# Altium schematic sheet SPI Counter.SchDoc: SPI Counter
size A3; SheetNumber: 1; SheetTotal: 1; PartNumber: PNxxx; Drawn By: Sebastian Kulik; ProjectName: DVT SPI Buffer
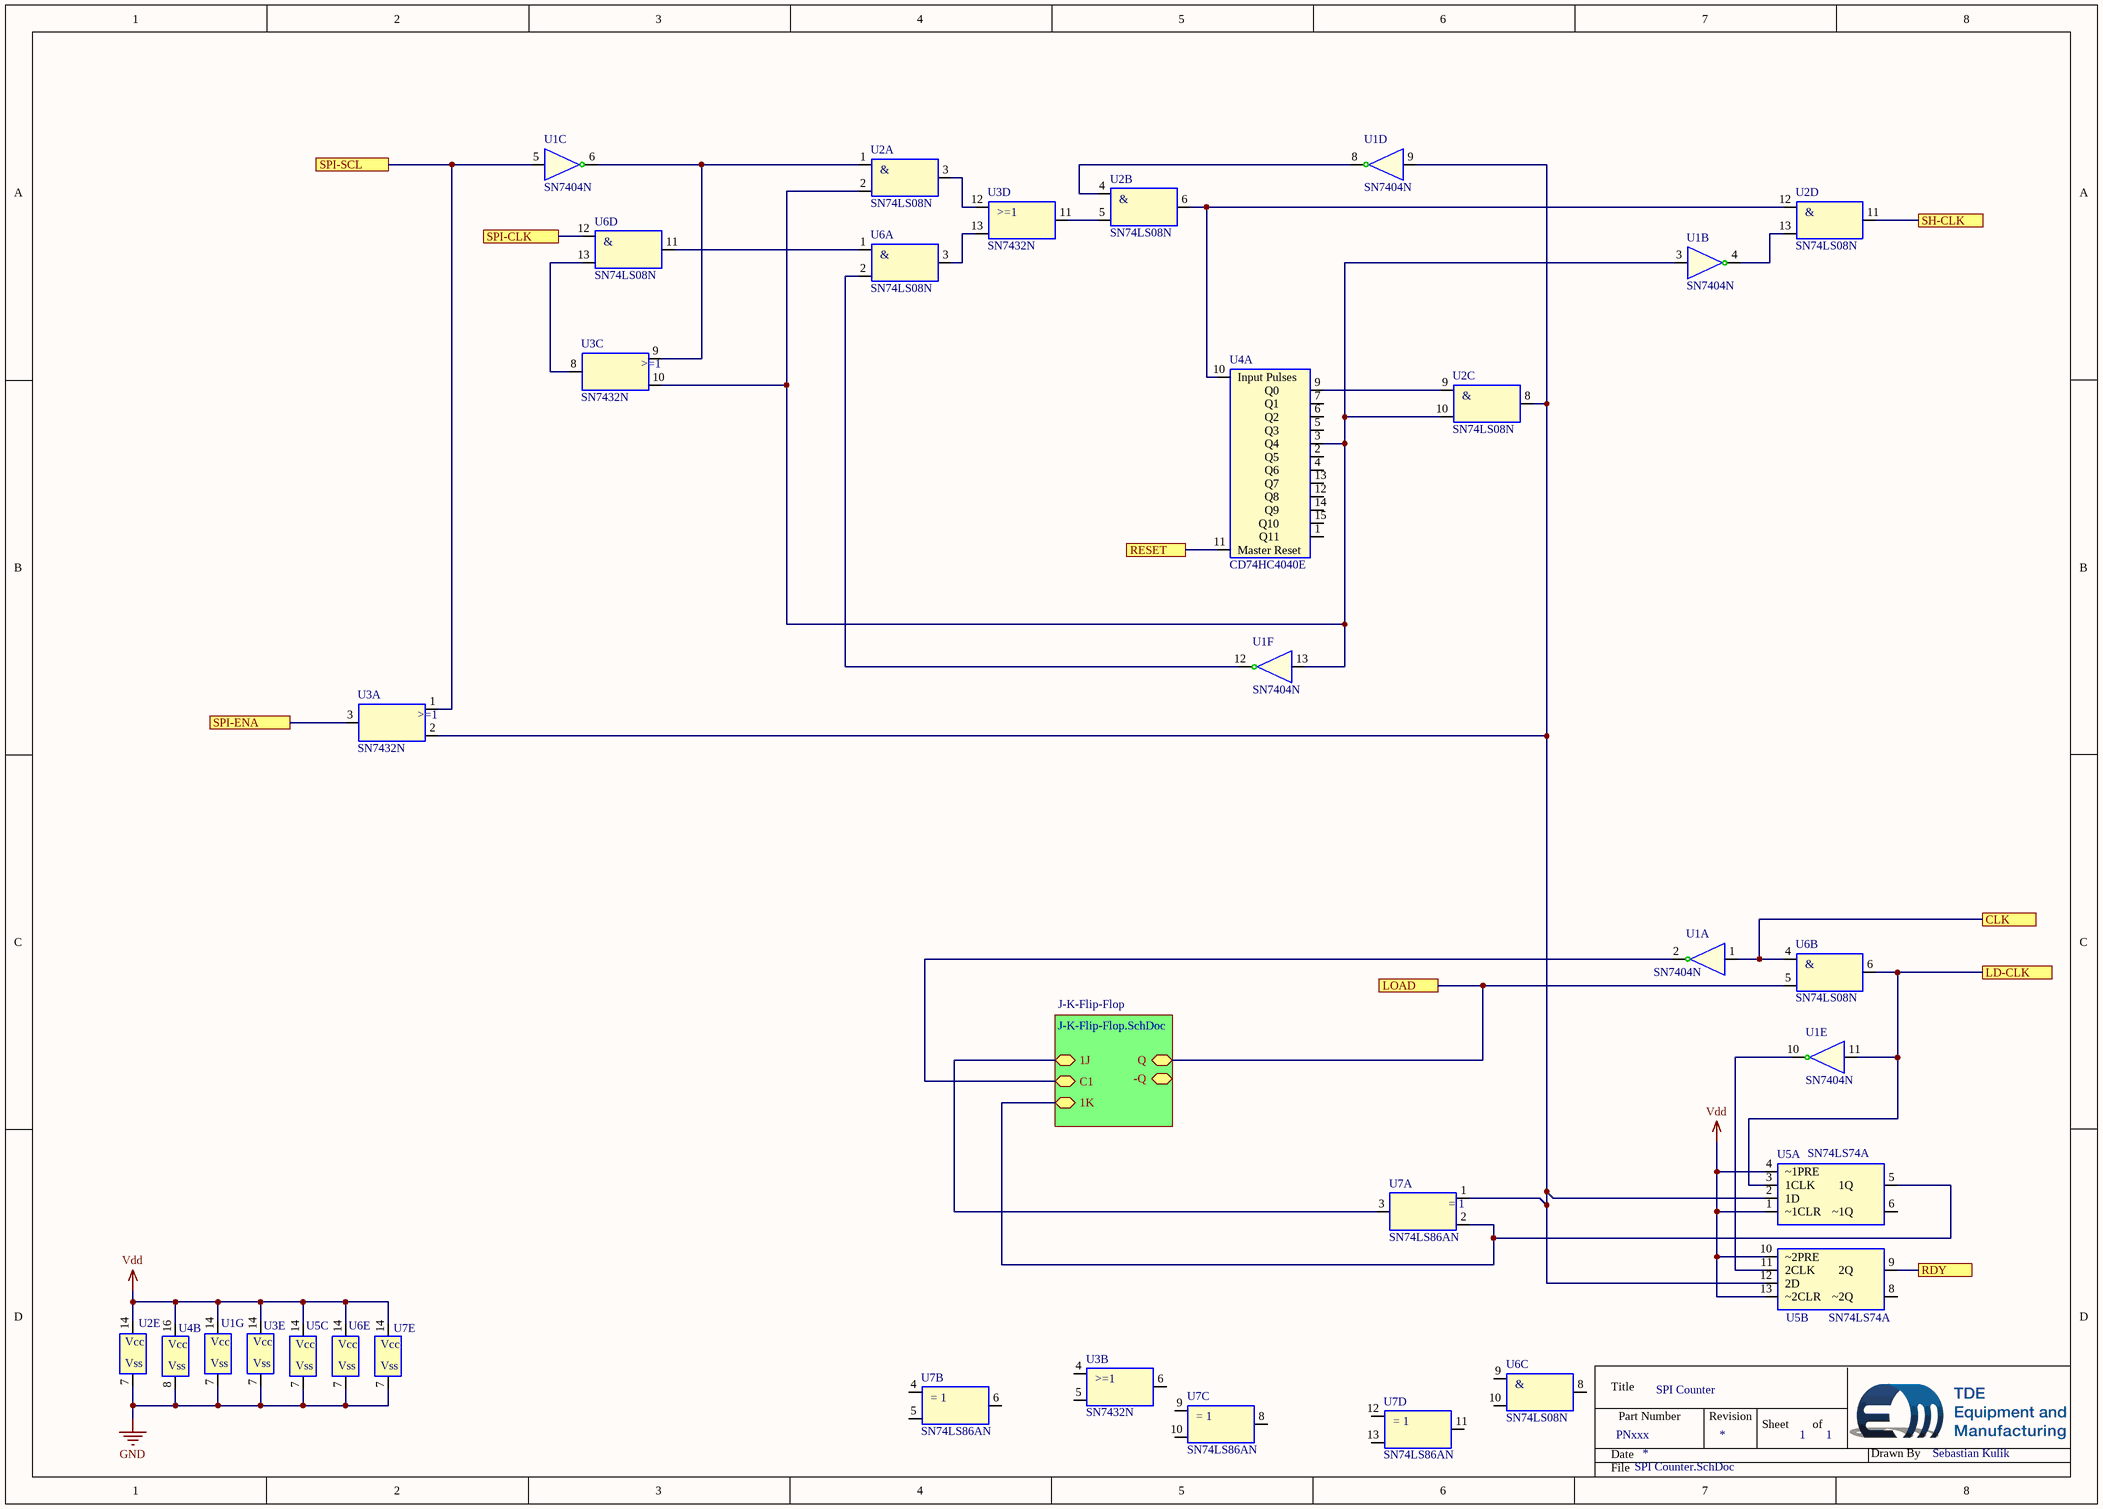
[diagram p0: SPI Counter.SchDoc]

## Parts
U1  SN7404N  [DIP-14]  (parts A,B,C,D,E,F,G of 7)
U2  SN74LS08N  [DIP-14]  (parts A,B,C,D,E of 5)
U3  SN7432N  [DIP-14]  (parts A,B,C,D,E of 5)
U4  CD74HC4040E  [DIP-16]  (parts A,B of 2)
U5  SN74LS74A  [DIP-14]  (parts A,B,C of 3)
U6  SN74LS08N  [DIP-14]  (parts A,B,C,D,E of 5)
U7  SN74LS86AN  [DIP-14]  (parts A,B,C,D,E of 5)

## Sub-sheets
J-K-Flip-Flop = J-K-Flip-Flop.SchDoc: 1J, C1, 1K, Q, -Q

## Ports
CLK, LD-CLK, LOAD, RDY, RESET, SH-CLK, SPI-CLK, SPI-ENA, SPI-SCL

## Nets
GND: U1.7(Vss) U2.7(Vss) U3.7(Vss) U4.8(Vss) U5.7(Vss) U6.7(Vss) U7.7(Vss)
Vdd: U1.14(Vcc) U2.14(Vcc) U3.14(Vcc) U4.16(Vcc) U5.1(~1CLR) U5.4(~1PRE) U5.10(~2PRE) U5.13(~2CLR) U5.14(Vcc) U6.14(Vcc) U7.14(Vcc)
CLK: U1.1(1A) U6.4(2A) ; port CLK
LD-CLK: U1.11(5A) U5.3(1CLK) U6.6(Y2) ; port LD-CLK
LOAD: U6.5(2B) ; port LOAD, sheet J-K-Flip-Flop/Q
RDY: U5.9(2Q) ; port RDY
RESET: U4.11(Master_Reset) ; port RESET
SH-CLK: U2.11(Y4) ; port SH-CLK
SPI-CLK: U6.12(4A) ; port SPI-CLK
SPI-ENA: U3.3(Y1) ; port SPI-ENA
SPI-SCL: U1.5(3A) U3.1(1A) ; port SPI-SCL
NetU1_2: U1.2(1Y) ; sheet J-K-Flip-Flop/C1
NetU1_3: U1.3(2A) U1.13(6A) U2.2(1B) U2.10(3B) U3.10(3B) U4.3(Q4)
NetU1_4: U1.4(2Y) U2.13(4B)
NetU1_6: U1.6(3Y) U2.1(1A) U3.9(3A)
NetU1_8: U1.8(Y4) U2.4(2A)
NetU1_9: U1.9(4A) U2.8(Y3) U3.2(1B) U5.2(1D) U5.12(2D) U7.1(1A)
NetU1_10: U1.10(5Y) U5.11(2CLK)
NetU1_12: U1.12(6Y) U6.2(1B)
NetU2_3: U2.3(Y1) U3.12(4A)
NetU2_5: U2.5(2B) U3.11(Y4)
NetU2_6: U2.6(Y2) U2.12(4A) U4.10(Input_Pulses)
NetU2_9: U2.9(3A) U4.9(Q0)
NetU3_8: U3.8(Y3) U6.13(4B)
NetU3_13: U3.13(4B) U6.3(Y1)
NetU5_5: U5.5(1Q) U7.2(1B) ; sheet J-K-Flip-Flop/1K
NetU6_1: U6.1(1A) U6.11(Y4)
NetU7_3: U7.3(Y1) ; sheet J-K-Flip-Flop/1J

Not connected (* = marked no-connect by the designer): U3 4(2A) 5(2B) 6(Y2); U4 1(Q11) 2(Q5) 4(Q6) 5(Q3) 6(Q2) 7(Q1) 12(Q8) 13(Q7) 14(Q9) 15(Q10); U5 6(~1Q) 8(~2Q); U6 8(Y3) 9(3A) 10(3B); U7 4(2A) 5(2B) 6(Y2) 8(Y3) 9(3A) 10(3B) 11(Y4) 12(4A) 13(4B)

## Notes on the sheet
- Title
- Date
- Part Number
- Revision
- Sheet
- of
- Drawn By
- File
- (in symbol SN74LS08N, part A) &
- (in symbol SN74LS08N, part B) &
- (in symbol SN74LS08N, part C) &
- (in symbol SN74LS08N, part D) &
- (in symbol SN7432N, part A) >=1
- (in symbol SN7432N, part B) >=1
- (in symbol SN7432N, part C) >=1
- (in symbol SN7432N, part D) >=1

## Library data of the parts
U1 = SN7404N: Hex Inverter TTL; Deliverer PartNr: 305-529; Manufacturer: TI; Deliverer: RS; TDE-PN: IC0086; Published: 24.11.2016; PackageDescription: DIP14; Publisher: Sebastian Kulik; Manufacturer PartNr: SN7404N; Price: 1
U2 U6 = SN74LS08N: Quad AND, TTL; Deliverer PartNr: 307-519; Manufacturer: TI; Deliverer: RS; TDE-PN: IC0088; Published: 24.11.2016; PackageDescription: DIP14; Publisher: Sebastian Kulik; Manufacturer PartNr: SN74LS08N; Price: 0.56
U3 = SN7432N: Quad NAND, TTL; Deliverer PartNr: 304-093; Manufacturer: TI; Deliverer: RS; TDE-PN: IC0087; Published: 24.11.2016; PackageDescription: DIP14; Publisher: Sebastian Kulik; Manufacturer PartNr: SN7432N; Price: 1.24
U4 = CD74HC4040E: High Speed CMOS Logic 12-Stage Binary Counter; Deliverer PartNr: 807-2457; Manufacturer: TI; Deliverer: RS; TDE-PN: IC0090; Published: 09.12.2016; PackageDescription: DIP16; Publisher: Sebastian Kulik; Manufacturer PartNr: CD74HC4040E; Price: 0.464/25
U5 = SN74LS74A: Flip-Flop Dual, TTL; Deliverer PartNr: 307-597; Manufacturer PartNr: SN74LS74AN; Manufacturer: TI; Deliverer: RS; TDE-PN: IC0089; Published: 24.11.2016; PackageDescription: DIP14; Publisher: Sebastian Kulik; Price: 0.48
U7 = SN74LS86AN: Quad 2-input exclusive-OR gates; Deliverer PartNr: 304-093; Manufacturer: TI; Deliverer: RS; TDE-PN: IC0091; Published: 12.12.2016; PackageDescription: DIP14; Publisher: Sebastian Kulik; Manufacturer PartNr: SN74LS86AN; Price: 2.26/1